# Altium schematic sheet display.SchDoc
size A3; DocumentNumber: 2; SheetNumber: 2; SheetTotal: 6; PageSetup: Record=PageOptions|CenterHorizontal=True|CenterVertical=True|PrintScale=0.97|XCorrection=1.00|YCorrection=1.00|PrintKind=1|BorderSize=5000000|LeftOffset=0|BottomOffset=0|Orientation=2|PaperLength=2970|PaperWidth=2100|Scale=100|PaperSource=7|PrintQuality=600|MediaType=1|DitherType=10|PaperKind=A4|PrintScaleMode=1
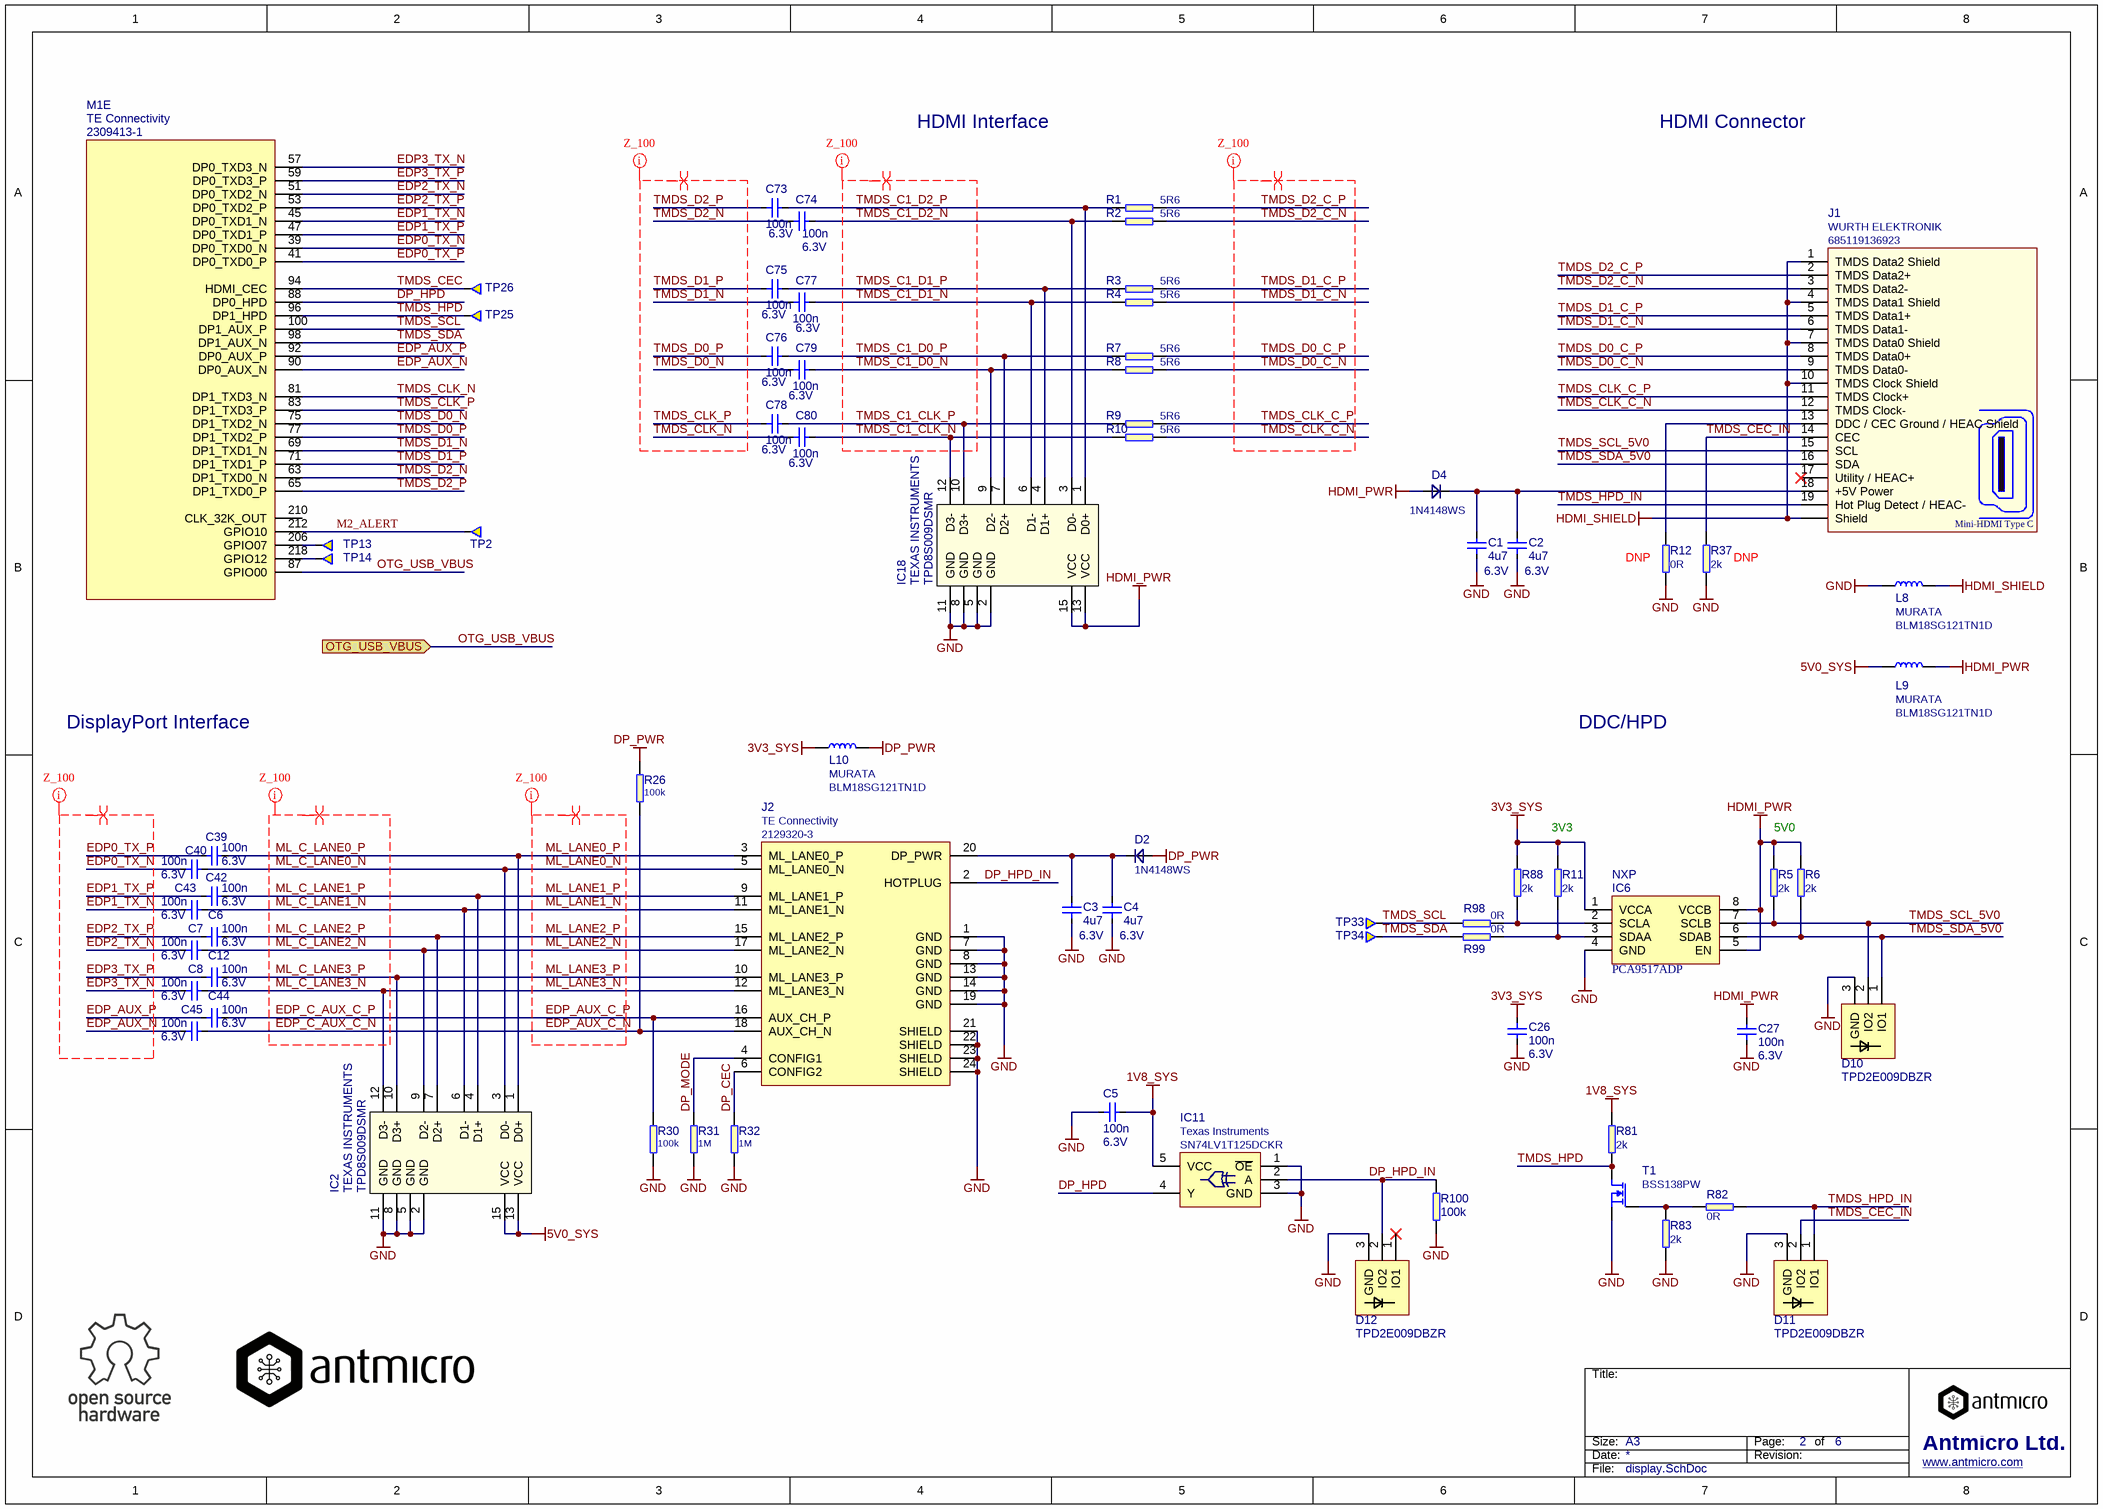
[diagram p0: display.SchDoc]

## Parts
C1  Voltage: 6.3V  [0402]  (hidden comment: 4u7)
C2  Voltage: 6.3V  [0402]  (hidden comment: 4u7)
C3  Voltage: 6.3V  [0402]  (hidden comment: 4u7)
C4  Voltage: 6.3V  [0402]  (hidden comment: 4u7)
C5  Voltage: 6.3V  [0402]  (hidden comment: 100n)
C6  Voltage: 6.3V  [0402]  (hidden comment: 100n)
C7  Voltage: 6.3V  [0402]  (hidden comment: 100n)
C8  Voltage: 6.3V  [0402]  (hidden comment: 100n)
C12  Voltage: 6.3V  [0402]  (hidden comment: 100n)
C26  Voltage: 6.3V  [0402]  (hidden comment: 100n)
C27  Voltage: 6.3V  [0402]  (hidden comment: 100n)
C39  Voltage: 6.3V  [0402]  (hidden comment: 100n)
C40  Voltage: 6.3V  [0402]  (hidden comment: 100n)
C42  Voltage: 6.3V  [0402]  (hidden comment: 100n)
C43  Voltage: 6.3V  [0402]  (hidden comment: 100n)
C44  Voltage: 6.3V  [0402]  (hidden comment: 100n)
C45  Voltage: 6.3V  [0402]  (hidden comment: 100n)
C73  Voltage: 6.3V  [0402]  (hidden comment: 100n)
C74  Voltage: 6.3V  [0402]  (hidden comment: 100n)
C75  Voltage: 6.3V  [0402]  (hidden comment: 100n)
C76  Voltage: 6.3V  [0402]  (hidden comment: 100n)
C77  Voltage: 6.3V  [0402]  (hidden comment: 100n)
C78  Voltage: 6.3V  [0402]  (hidden comment: 100n)
C79  Voltage: 6.3V  [0402]  (hidden comment: 100n)
C80  Voltage: 6.3V  [0402]  (hidden comment: 100n)
D2  1N4148WS  [SOD-323]
D4  1N4148WS  [SOD-323]
D10  TPD2E009DBZR  [SOT-23s]
D11  TPD2E009DBZR  [SOT-23s]
D12  TPD2E009DBZR  [SOT-23s]
IC2  Manufacturer: TEXAS INSTRUMENTS  PartSymbol: TPD8S009DSMR  [SON-15]  (hidden comment: TPD8S009)
IC6  PCA9517ADP  [MSOP-8]
IC11  SN74LV1T125DCKR  Manufacturer: Texas Instruments  [SC70-5]
IC18  Manufacturer: TEXAS INSTRUMENTS  PartSymbol: TPD8S009DSMR  [SON-15]  (hidden comment: TPD8S009)
J1  685119136923  Manufacturer: WURTH ELEKTRONIK  [WE_685119136923]
J2  2129320-3  Manufacturer: TE Connectivity  [2129320-3]
L8  BLM18SG121TN1D  Manufacturer: MURATA  [0603]
L9  BLM18SG121TN1D  Manufacturer: MURATA  [0603]
L10  BLM18SG121TN1D  Manufacturer: MURATA  [0603]
M1  Manufacturer: TE Connectivity  [jetson-nano-connector]  (hidden comment: 2309413-1)  (part E of 7)
R1  5R6  [0402]
R2  5R6  [0402]
R3  5R6  [0402]
R4  5R6  [0402]
R5  2k  [0402]
R6  2k  [0402]
R7  5R6  [0402]
R8  5R6  [0402]
R9  5R6  [0402]
R10  5R6  [0402]
R11  2k  [0402]
R12  0R  [0402]
R26  100k  [0402]
R30  100k  [0402]
R31  1M  [0402]
R32  1M  [0402]
R37  2k  [0402]
R81  2k  [0402]
R82  0R  [0402]
R83  2k  [0402]
R88  2k  [0402]
R98  0R  [0402]
R99  0R  [0402]
R100  100k  [0402]
T1  BSS138PW  [SC70-3]
TP2  Testpad  [TP-R-1.5]  (value not drawn)  (no BOM)
TP13  Testpad  [TP-R-1.5]  (value not drawn)  (no BOM)
TP14  Testpad  [TP-R-1.5]  (value not drawn)  (no BOM)
TP25  Testpad  [TP-R-1.5]  (value not drawn)  (no BOM)
TP26  Testpad  [TP-R-1.5]  (value not drawn)  (no BOM)
TP33  Testpad  [TP-R-1.5]  (value not drawn)  (no BOM)
TP34  Testpad  [TP-R-1.5]  (value not drawn)  (no BOM)

## Ports
OTG_USB_VBUS (in)

## Nets
1V8_SYS: C5.2 IC11.5(VCC) R81.1
3V3_SYS: C26.1 IC6.1(VCCA) L10.1 R11.1 R88.1
5V0_SYS: IC2.13(VCC) IC2.15(VCC) L9.1
DP_PWR: D2.A L10.2 R26.2
GND: C1.1 C2.1 C3.1 C4.1 C5.1 C26.2 C27.1 D10.3(GND) D11.3(GND) D12.3(GND) IC2.2(GND) IC2.5(GND) IC2.8(GND) IC2.11(GND) IC6.4(GND) IC11.1(~{OE}) IC11.3(GND) IC18.2(GND) IC18.5(GND) IC18.8(GND) IC18.11(GND) J2.1(GND) J2.7(GND) J2.8(GND) J2.13(GND) J2.14(GND) J2.19(GND) J2.21(SHIELD) J2.22(SHIELD) J2.23(SHIELD) J2.24(SHIELD) L8.1 R12.1 R30.1 R31.1 R32.1 R37.2 R83.2 R100.1 T1.2(S)
HDMI_PWR: C27.2 D4.A IC6.5(EN) IC6.8(VCCB) IC18.13(VCC) IC18.15(VCC) L9.2 R5.1 R6.1
HDMI_SHIELD: J1.1(TMDS_Data2_Shield) J1.4(TMDS_Data1_Shield) J1.7(TMDS_Data0_Shield) J1.10(TMDS_Clock_Shield) J1.Shell(Shield) L8.2
DP_CEC: J2.6(CONFIG2) R32.2
DP_HPD: IC11.4(Y) M1.88(DP0_HPD)
DP_HPD_IN: D12.2(IO2) IC11.2(A) J2.2(HOTPLUG) R100.2
DP_MODE: J2.4(CONFIG1) R31.2
EDP0_TX_N: C40.1 M1.39(DP0_TXD0_N)
EDP0_TX_P: C39.1 M1.41(DP0_TXD0_P)
EDP1_TX_N: C43.1 M1.45(DP0_TXD1_N)
EDP1_TX_P: C42.1 M1.47(DP0_TXD1_P)
EDP2_TX_N: C7.1 M1.51(DP0_TXD2_N)
EDP2_TX_P: C6.1 M1.53(DP0_TXD2_P)
EDP3_TX_N: C12.1 M1.57(DP0_TXD3_N)
EDP3_TX_P: C8.1 M1.59(DP0_TXD3_P)
EDP_AUX_C_N: C45.2 J2.18(AUX_CH_N) R26.1  [also labelled EDP_C_AUX_C_N]
EDP_AUX_C_P: C44.2 J2.16(AUX_CH_P) R30.2  [also labelled EDP_C_AUX_C_P]
EDP_AUX_N: C45.1 M1.90(DP0_AUX_N)
EDP_AUX_P: C44.1 M1.92(DP0_AUX_P)
M2_ALERT: M1.212(GPIO10) TP2.1
ML_C_LANE0_N: C40.2 IC2.3(D0-) J2.5(ML_LANE0_N)  [also labelled ML_LANE0_N]
ML_C_LANE0_P: C39.2 IC2.1(D0+) J2.3(ML_LANE0_P)  [also labelled ML_LANE0_P]
ML_C_LANE1_N: C43.2 IC2.6(D1-) J2.11(ML_LANE1_N)  [also labelled ML_LANE1_N]
ML_C_LANE1_P: C42.2 IC2.4(D1+) J2.9(ML_LANE1_P)  [also labelled ML_LANE1_P]
ML_C_LANE2_N: C7.2 IC2.9(D2-) J2.17(ML_LANE2_N)  [also labelled ML_LANE2_N]
ML_C_LANE2_P: C6.2 IC2.7(D2+) J2.15(ML_LANE2_P)  [also labelled ML_LANE2_P]
ML_C_LANE3_N: C12.2 IC2.12(D3-) J2.12(ML_LANE3_N)  [also labelled ML_LANE3_N]
ML_C_LANE3_P: C8.2 IC2.10(D3+) J2.10(ML_LANE3_P)  [also labelled ML_LANE3_P]
OTG_USB_VBUS: M1.87(GPIO00) ; port OTG_USB_VBUS
TMDS_C1_CLK_N: C80.2 IC18.12(D3-) R10.1
TMDS_C1_CLK_P: C78.2 IC18.10(D3+) R9.1
TMDS_C1_D0_N: C79.2 IC18.9(D2-) R8.1
TMDS_C1_D0_P: C76.2 IC18.7(D2+) R7.1
TMDS_C1_D1_N: C77.2 IC18.6(D1-) R4.1
TMDS_C1_D1_P: C75.2 IC18.4(D1+) R3.1
TMDS_C1_D2_N: C74.2 IC18.3(D0-) R2.1
TMDS_C1_D2_P: C73.2 IC18.1(D0+) R1.1
TMDS_CEC: M1.94(HDMI_CEC) TP26.1
TMDS_CEC_IN: D11.2(IO2) J1.14(CEC) R37.1
TMDS_CLK_C_N: J1.12(TMDS_Clock-) R10.2
TMDS_CLK_C_P: J1.11(TMDS_Clock+) R9.2
TMDS_CLK_N: C80.1 M1.81(DP1_TXD3_N)
TMDS_CLK_P: C78.1 M1.83(DP1_TXD3_P)
TMDS_D0_C_N: J1.9(TMDS_Data0-) R8.2
TMDS_D0_C_P: J1.8(TMDS_Data0+) R7.2
TMDS_D0_N: C79.1 M1.75(DP1_TXD2_N)
TMDS_D0_P: C76.1 M1.77(DP1_TXD2_P)
TMDS_D1_C_N: J1.6(TMDS_Data1-) R4.2
TMDS_D1_C_P: J1.5(TMDS_Data1+) R3.2
TMDS_D1_N: C77.1 M1.69(DP1_TXD1_N)
TMDS_D1_P: C75.1 M1.71(DP1_TXD1_P)
TMDS_D2_C_N: J1.3(TMDS_Data2-) R2.2
TMDS_D2_C_P: J1.2(TMDS_Data2+) R1.2
TMDS_D2_N: C74.1 M1.63(DP1_TXD0_N)
TMDS_D2_P: C73.1 M1.65(DP1_TXD0_P)
TMDS_HPD: M1.96(DP1_HPD) R81.2 T1.3(D) TP25.1
TMDS_HPD_IN: D11.1(IO1) J1.19(Hot_Plug_Detect_/_HEAC-) R82.1
TMDS_SCL: M1.100(DP1_AUX_P) R98.2 TP33.1
TMDS_SCL_5V0: D10.2(IO2) IC6.7(SCLB) J1.15(SCL) R5.2
TMDS_SDA: M1.98(DP1_AUX_N) R99.2 TP34.1
TMDS_SDA_5V0: D10.1(IO1) IC6.6(SDAB) J1.16(SDA) R6.2
NetC1_2: C1.2 C2.2 D4.C J1.18(+5V_Power)
NetC3_2: C3.2 C4.2 D2.C J2.20(DP_PWR)
NetIC6_2: IC6.2(SCLA) R88.2 R98.1
NetIC6_3: IC6.3(SDAA) R11.2 R99.1
NetJ1_13: J1.13(DDC_/_CEC_Ground_/_HEAC_Shield) R12.2
NetM1_206: M1.206(GPIO07) TP13.1
NetM1_218: M1.218(GPIO12) TP14.1
NetR82_2: R82.2 R83.1 T1.1(G)

Not connected (* = marked no-connect by the designer): D12 1(IO1)*; J1 17(Utility_/_HEAC+)*; M1 210(CLK_32K_OUT)

## Layout directives
differential pair: EDP0_TX_N, EDP0_TX_P, EDP1_TX_N, EDP1_TX_P, EDP2_TX_N, EDP2_TX_P, EDP3_TX_N, EDP3_TX_P, EDP_AUX_C_N, EDP_AUX_C_P, EDP_AUX_N, EDP_AUX_P, EDP_C_AUX_C_N, EDP_C_AUX_C_P, ML_C_LANE0_N, ML_C_LANE0_P, ML_C_LANE1_N, ML_C_LANE1_P, ML_C_LANE2_N, ML_C_LANE2_P, ML_C_LANE3_N, ML_C_LANE3_P, ML_LANE0_N, ML_LANE0_P, ML_LANE1_N, ML_LANE1_P, ML_LANE2_N, ML_LANE2_P, ML_LANE3_N, ML_LANE3_P, TMDS_C1_CLK_N, TMDS_C1_CLK_P, TMDS_C1_D0_N, TMDS_C1_D0_P, TMDS_C1_D1_N, TMDS_C1_D1_P, TMDS_C1_D2_N, TMDS_C1_D2_P, TMDS_CLK_C_N, TMDS_CLK_C_P, TMDS_CLK_N, TMDS_CLK_P, TMDS_D0_C_N, TMDS_D0_C_P, TMDS_D0_N, TMDS_D0_P, TMDS_D1_C_N, TMDS_D1_C_P, TMDS_D1_N, TMDS_D1_P, TMDS_D2_C_N, TMDS_D2_C_P, TMDS_D2_N, TMDS_D2_P
net class Z_100: EDP0_TX_N, EDP0_TX_P, EDP1_TX_N, EDP1_TX_P, EDP2_TX_N, EDP2_TX_P, EDP3_TX_N, EDP3_TX_P, EDP_AUX_C_N, EDP_AUX_C_P, EDP_AUX_N, EDP_AUX_P, EDP_C_AUX_C_N, EDP_C_AUX_C_P, ML_C_LANE0_N, ML_C_LANE0_P, ML_C_LANE1_N, ML_C_LANE1_P, ML_C_LANE2_N, ML_C_LANE2_P, ML_C_LANE3_N, ML_C_LANE3_P, ML_LANE0_N, ML_LANE0_P, ML_LANE1_N, ML_LANE1_P, ML_LANE2_N, ML_LANE2_P, ML_LANE3_N, ML_LANE3_P, TMDS_C1_CLK_N, TMDS_C1_CLK_P, TMDS_C1_D0_N, TMDS_C1_D0_P, TMDS_C1_D1_N, TMDS_C1_D1_P, TMDS_C1_D2_N, TMDS_C1_D2_P, TMDS_CLK_C_N, TMDS_CLK_C_P, TMDS_CLK_N, TMDS_CLK_P, TMDS_D0_C_N, TMDS_D0_C_P, TMDS_D0_N, TMDS_D0_P, TMDS_D1_C_N, TMDS_D1_C_P, TMDS_D1_N, TMDS_D1_P, TMDS_D2_C_N, TMDS_D2_C_P, TMDS_D2_N, TMDS_D2_P

## Notes on the sheet
- HDMI Interface
- HDMI Connector
- 1V8
- (near R12) DNP
- (near R37) DNP
- DisplayPort Interface
- DDC/HPD
- 3V3
- 5V0
- (near IC6) NXP
- Title:
- Size:
- Date:
- A3
- Revision:
- Page:
- of
- Antmicro Ltd.
- File:
- www.antmicro.com
- (in symbol WE_685119136923) Mini-HDMI Type C

## Library data of the parts
C1-C4 = C_4u7_0402: MLCC SMT Capacitor 4.7uF 0402; Manufacturer: MURATA; PartSymbol: GRM155R60J475ME87D; PartNumber: C_4u7_0402; Value: 4u7
C5-C8 C12 C26 C27 C39 C40 C42-C45 C73-C80 = C_100n_0402: MLCC SMT Capacitor 100n 0402; Manufacturer: TDK; PartSymbol: C1005X5R0J104K050BA; Value: 100n; PartNumber: C_100n_0402
D2 D4 = diode: Diode small signal; Manufacturer: ON SEMICONDUCTOR; Value: 1N4148WS; PartNumber: 1N4148WS; PartSymbol: 1N4148WS
D10-D12 = TPD2E009DBZR: DIODE, SCHOTTKY, 30V, 200MA, SOT-23; Manufacturer: NXP; PartNumber: TPD2E009DBZR; Value: TPD2E009DBZR; MPN: TPD2E009DBZR
IC2 IC18 = TPD8S009: 8-Channel ESD Protection for DisplayPort and HDMI; Value: TPD8S009; PartNumber: TPD8S009
IC6 = PCA9517ADP: IC REDRIVER I2C 1CH 8TSSOP; Manufacturer: NXP; Value: PCA9517ADP; PartNumber: PCA9517ADP; PartSymbol: PCA9517ADP
IC11 = SN74LV1T125: Buffer, 74LV1T125, 1.6 V to 5.5 V, SOT-23-5; PartNumber: SN74LV1T125DCKR; Value: SN74LV1T125DCKR; PartSymbol: SN74LV1T125DCKR
J1 = WE_685119136923: CONN HDMI FEMALE R/A 19POS 2.6MM; PartNumber: WE_685119136923; Value: 685119136923; PartSymbol: WE_685119136923
J2 = miniDP: Mini Displayport Reverse Offset; PartNumber: 2129320-3; Value: 2129320-3; PartSymbol: 2129320-3
L8-L10 = BLM18SG121TN1D: FERRITE BEAD, 0.025OHM, 3A, 0603; Value: BLM18SG121TN1D; PartNumber: BLM18SG121TN1D; PartSymbol: BLM18SG121TN1D
M1 = jetson-nano-new-release: PartNumber: 2309413-1; PartSymbol: 2309413-1; Value: 2309413-1
R1-R4 R7-R10 = R_5R6_0402: RES, 5R6, 0402; Manufacturer: Panasonic; PartSymbol: ERJ2GEJ5R6X; PartNumber: R_5R6_0402; Value: 5R6
R5 R6 R11 R37 R81 R83 R88 = R_2k_0402: RES, 2k, 0402; Manufacturer: VISHAY; PartSymbol: CRCW04022K00FKED; PartNumber: R_2k_0402; Value: 2k
R12 R82 R98 R99 = R_0R_0402: RES, 0R, 0402; Manufacturer: Panasonic; PartSymbol: ERJ2GE0R00X; PartNumber: R_0R_0402; Value: 0R
R26 R30 R100 = R_100k_0402: SMT Resistor 100k 0402; Manufacturer: VISHAY; PartSymbol: CRCW0402100KFKEDHP; Tolerance: 1%; PartNumber: R_100k_0402; Value: 100k
R31 R32 = R_1M_0402: SMT Resistor 1M 0402; Manufacturer: VISHAY; PartSymbol: CRCW04021M00FKED; Tolerance: 1%; PartNumber: R_1M_0402; Value: 1M
T1 = NMOS: MOSFET, N CH, 60V, 0.2A; Manufacturer: NXP; Value: BSS138PW; PartNumber: BSS138PW; PartSymbol: BSS138PW
TP2 TP13 TP14 TP25 TP26 TP33 TP34 = Testpad: Testpad, round, 1.5mm; PartNumber: TP-R-1.5